# EAGLE design aa battery (EAGLE 6.4)
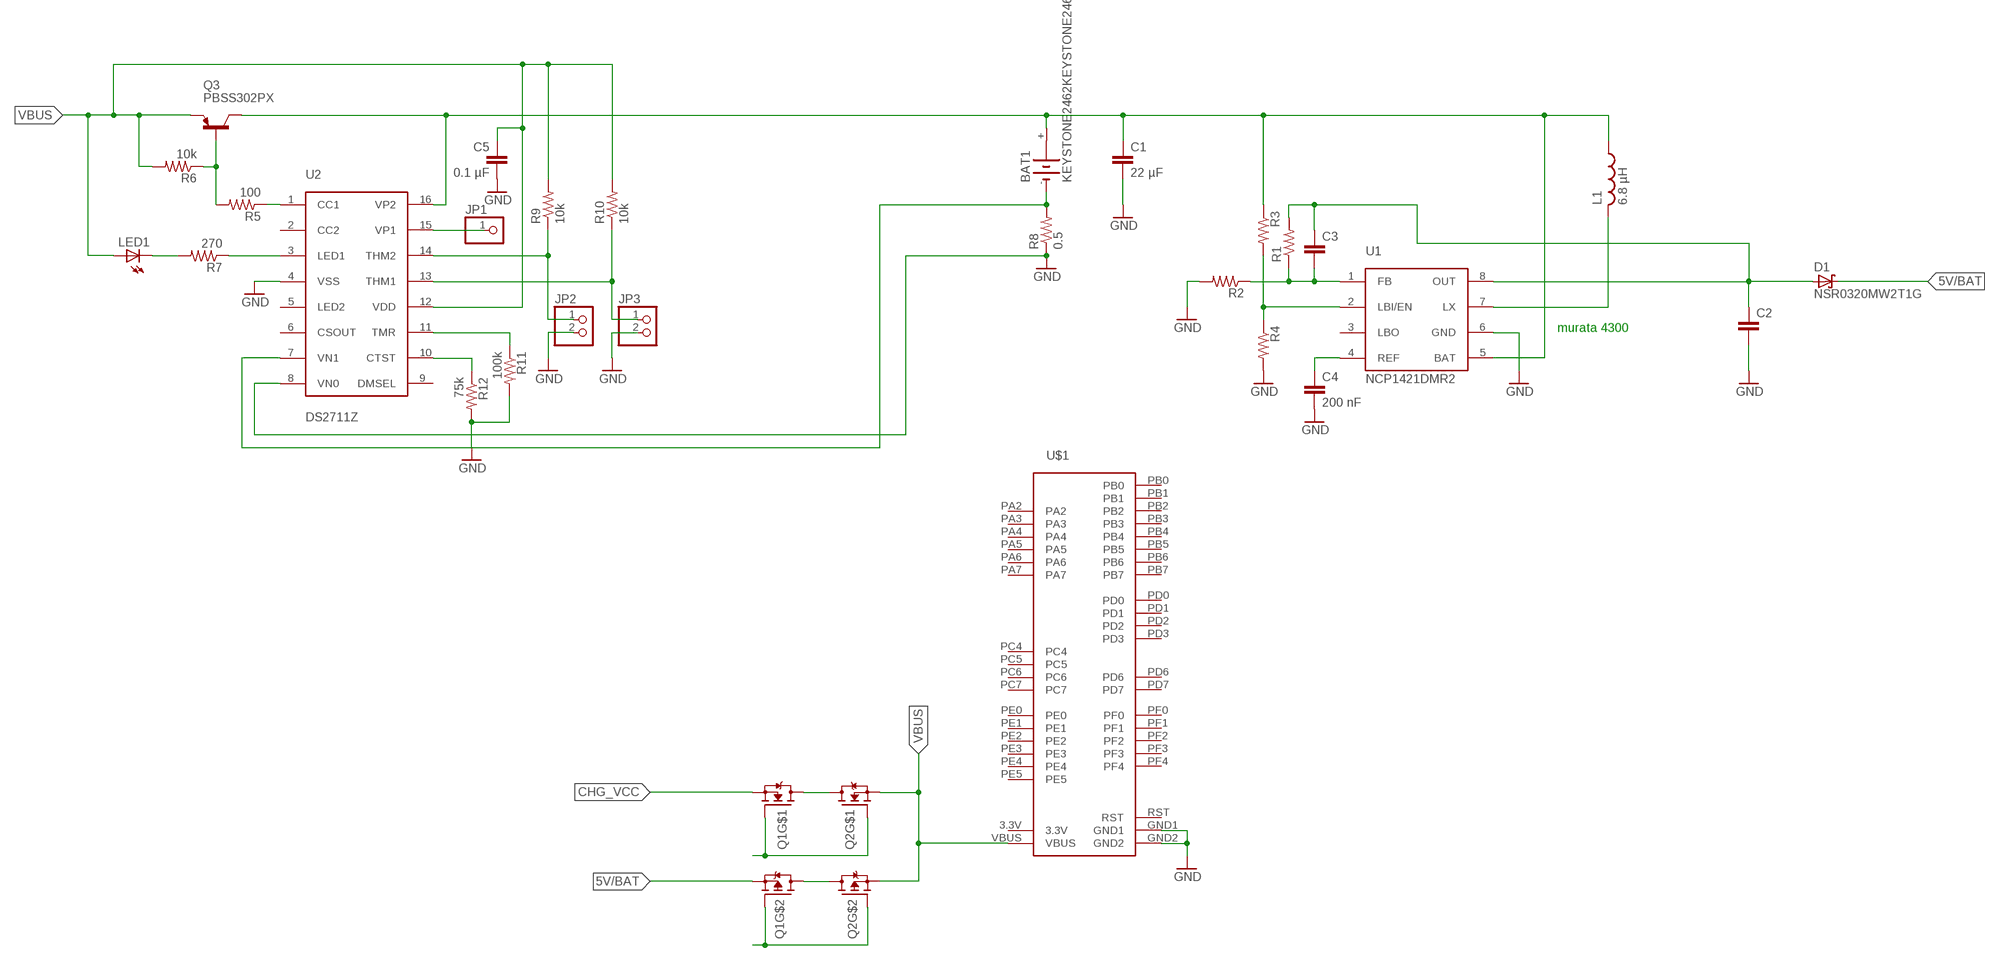
[diagram p0: schematic, sheet 1]

## Parts
BAT1  KEYSTONE2462KEYSTONE2462  [KEYSTONE2462]
C1  22 µF  C-EUC0805  [C0805]
C2  C-EUC1210  [C1210]
C3  C-EUC0805  [C0805]
C4  200 nF  C-EUC0805  [C0805]
C5  0.1 µF  C-EUC0805  [C0805]
D1  NSR0320MW2T1G  SCHOTTKY-DIODENSR0320MW2T1G  [SOD323]
JP1  PINHD-1X1  [1X01]
JP2  PINHD-1X2  [1X02]
JP3  PINHD-1X2  [1X02]
L1  6.8 µH  L-USMURATA4500  [MURATA4500]
LED1  LED5MM  [LED5MM]
Q1  DMC2038LVT-7  [TSOT26]
Q2  DMC2038LVT-7  [TSOT26]
Q3  PBSS302PX  BF621-PNP-SOT98-BCE  [SOT89-BCE]
R1  R-US_R0805  [R0805]
R2  R-US_R0805  [R0805]
R3  R-US_R0805  [R0805]
R4  R-US_R0805  [R0805]
R5  100  R-US_R0805  [R0805]
R6  10k  R-US_R0805  [R0805]
R7  270  R-US_R0805  [R0805]
R8  0.5  R-US_R0805  [R0805]
R9  10k  R-US_R0805  [R0805]
R10  10k  R-US_R0805  [R0805]
R11  100k  R-US_R0805  [R0805]
R12  75k  R-US_R0805  [R0805]
U1  NCP1421DMR2  [MICRO8]
U2  DS2711Z  [SO16]
U$1  STELLARIS-LAUNCHPADSTELLARIS-LAUNCHPAD-XL  [LAUNCHPAD-XL]

## Nets
5V/BAT: D1.C Q1.2(S1)
CHG_VCC: Q1.5(S)
GND: C1.2 C2.2 C4.2 C5.2 JP2.2 JP3.2 R2.2 R4.2 R8.1 R11.2 R12.2 U1.6(GND) U2.4(VSS) U2.8(VN0) U$1.GND1 U$1.GND2
N$1: C4.1 U1.4(REF)
N$2: L1.2 U1.7(LX)
N$3: C3.2 R1.1 R2.1 U1.1(FB)
N$4: Q1.4(D1) Q2.4(D1)
N$5: R3.2 R4.1 U1.2(LBI/EN)
N$6: BAT1.+ C1.1 L1.1 Q3.C Q3.C@1(C) R3.1 U1.5(BAT) U2.16(VP2)
N$7: Q3.B R5.2 R6.1
N$8: Q1.6(D) Q2.6(D)
N$9: Q1.1(G) Q2.1(G)
N$10: R5.1 U2.1(CC1)
N$11: C2.1 C3.1 D1.A R1.2 U1.8(OUT)
N$12: Q1.3(G1) Q2.3(G1)
N$13: JP1.1 U2.15(VP1)
N$14: BAT1.- R8.2 U2.7(VN1)
N$15: LED1.K(C) R7.2
N$16: R7.1 U2.3(LED1)
N$17: JP2.1 R9.1 U2.14(THM2)
N$18: JP3.1 R10.1 U2.13(THM1)
N$20: R12.1 U2.10(CTST)
N$21: R11.1 U2.11(TMR)
VBUS: C5.1 LED1.A Q2.2(S1) Q2.5(S) Q3.E R6.2 R9.2 R10.2 U2.12(VDD) U$1.VBUS
Unconnected: U1.3(LBO) U2.2(CC2) U2.5(LED2) U2.6(CSOUT) U2.9(DMSEL) U$1.PA2 U$1.PA3 U$1.PA4 U$1.PA5 U$1.PA6 U$1.PA7 U$1.PB0 U$1.PB1 U$1.PB2 U$1.PB3 U$1.PB4 U$1.PB5 U$1.PB6 U$1.PB7 U$1.PC4 U$1.PC5 U$1.PC6 U$1.PC7 U$1.PD0 U$1.PD1 U$1.PD2 U$1.PD3 U$1.PD6 U$1.PD7 U$1.PE0 U$1.PE1 U$1.PE2 U$1.PE3 U$1.PE4 U$1.PE5 U$1.PF0 U$1.PF1 U$1.PF2 U$1.PF3 U$1.PF4

## Notes on the sheet
- murata 4300

## Power pins joined to a net without a drawn wire
3.3V: U$1.3.3V
RST: U$1.RST

## Library data of the parts
BAT1 = battery holders:KEYSTONE2462
C1-C5 = rcl:C-EU: CAPACITOR, European symbol
D1 = sod323-diode:SCHOTTKY-DIODE
JP1 = pinhead:PINHD-1X1: PIN HEADER
JP2 JP3 = pinhead:PINHD-1X2: PIN HEADER
L1 = inductors:L-US: INDUCTOR, American symbol
LED1 = led:LED: LED OSRAM: - CHIPLED LG R971, LG N971, LY N971, LG Q971, LY Q971, LO R971, LY R971 LH N974, LH R974 LS Q976, LO Q976, LY Q976 LO Q996 - Hyper CHIPLED LW Q18S LB Q993, LB Q99A, LB R99A - SideLED LS A670, LO A670, LY A670, LG A670, LP A670 LB A673, LV A673, LT A673, LW A673 LH A674 LY A675 LS A676, LA A676, LO A676, LY A676, LW A676 LS A679, LY A679, LG A679 - Hyper Micro SIDELED® LS Y876, LA Y876, LO Y876, LY Y876 LT Y87S - SmartLED LW L88C, LW L88S LB L89C, LB L89S, LG L890 LS L89K, LO L89K, LY L89K LS L896, LA L896, LO L896, LY L896 - TOPLED LS T670, LO T670, LY T670, LG T670, LP T670 LSG T670, LSP T670, LSY T670, LOP T670, LYG T670 LG T671, LOG T671, LSG T671 LB T673, LV T673, LT T673, LW T673 LH T674 LS T676, LA T676, LO T676, LY T676, LB T676, LH T676, LSB T676, LW T676 LB T67C, LV T67C, LT T67C, LS T67K, LO T67K, LY T67K, LW E67C LS E67B, LA E67B, LO E67B, LY E67B, LB E67C, LV E67C, LT E67C LW T67C LS T679, LY T679, LG T679 LS T770, LO T770, LY T770, LG T770, LP T770 LB T773, LV T773, LT T773, LW T773 LH T774 LS E675, LA E675, LY E675, LS T675 LS T776, LA T776, LO T776, LY T776, LB T776 LHGB T686 LT T68C, LB T68C - Hyper Mini TOPLED® LB M676 - Mini TOPLED Santana® LG M470 LS M47K, LO M47K, LY M47K Source: http://www.osram.convergy.de LUXEON: - LUMILED® LXK2-PW12-R00, LXK2-PW12-S00, LXK2-PW14-U00, LXK2-PW14-V00 LXK2-PM12-R00, LXK2-PM12-S00, LXK2-PM14-U00 LXK2-PE12-Q00, LXK2-PE12-R00, LXK2-PE12-S00, LXK2-PE14-T00, LXK2-PE14-U00 LXK2-PB12-K00, LXK2-PB12-L00, LXK2-PB12-M00, LXK2-PB14-N00, LXK2-PB14-P00, LXK2-PB14-Q00 LXK2-PR12-L00, LXK2-PR12-M00, LXK2-PR14-Q00, LXK2-PR14-R00 LXK2-PD12-Q00, LXK2-PD12-R00, LXK2-PD12-S00 LXK2-PH12-R00, LXK2-PH12-S00 LXK2-PL12-P00, LXK2-PL12-Q00, LXK2-PL12-R00 Source: www.luxeon.com KINGBRIGHT: KA-3528ASYC Source: www.kingbright.com
Q1 Q2 = mosfets:DMC2038LVT
Q3 = transistor-neu-to92:*-PNP-: PNP Transistror
R1-R12 = rcl:R-US_: RESISTOR, American symbol
U1 = NCP1421:NCP1421
U2 = DS2711:DS2711
U$1 = StellarisLaunchPad_Fred:STELLARIS-LAUNCHPAD

## Board
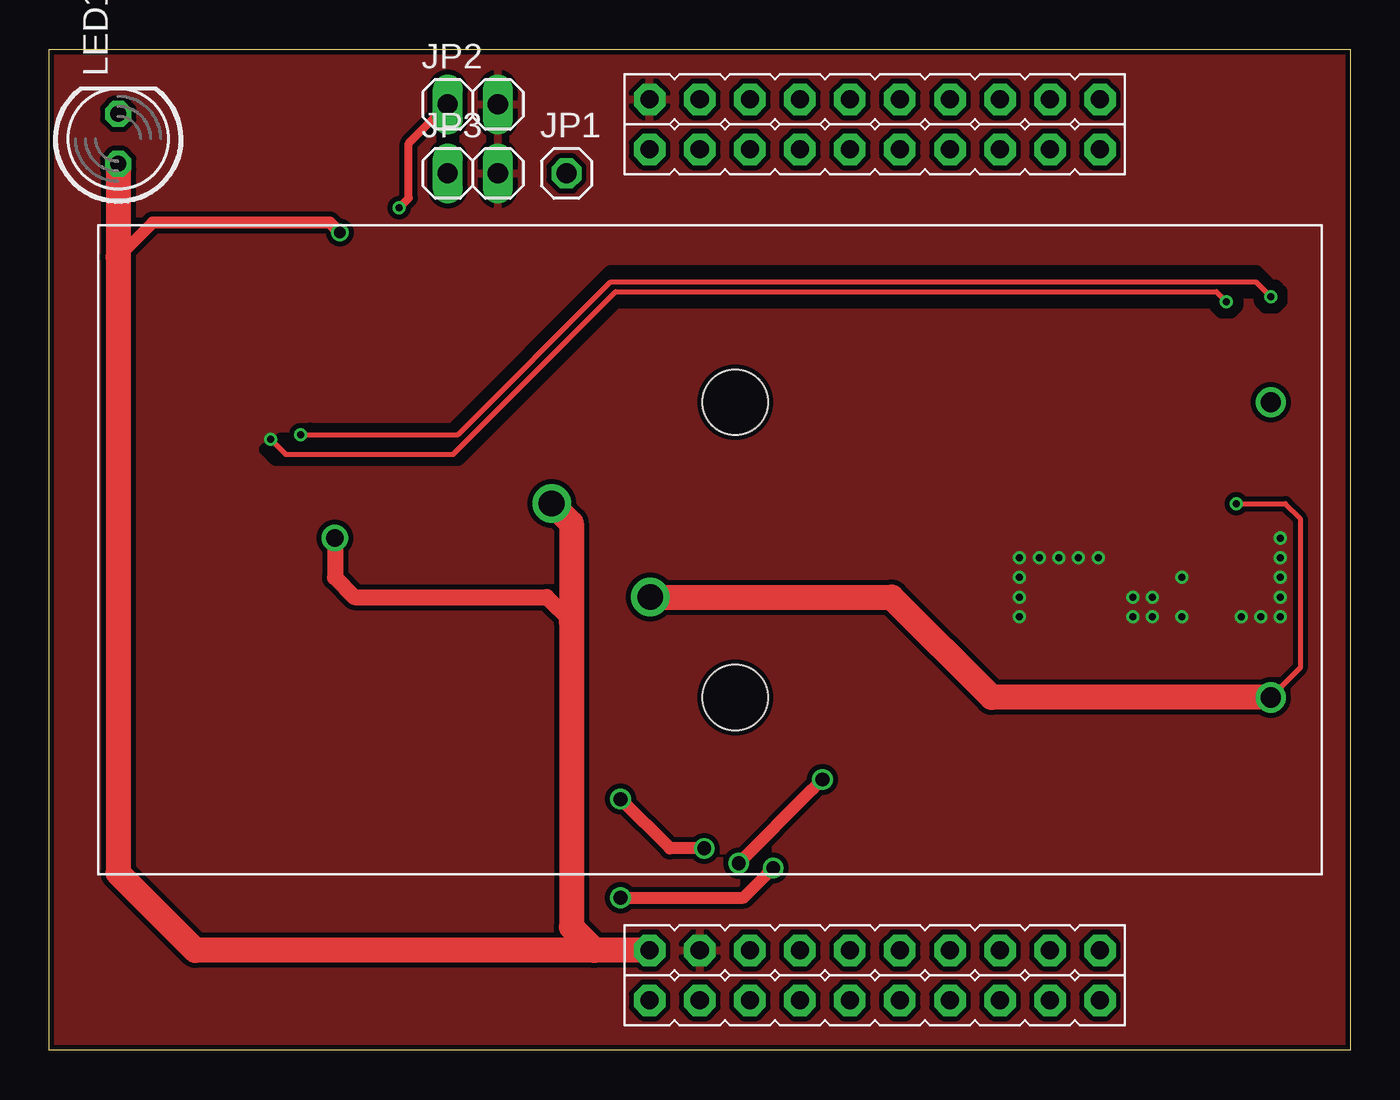
[diagram p1: board, top side]
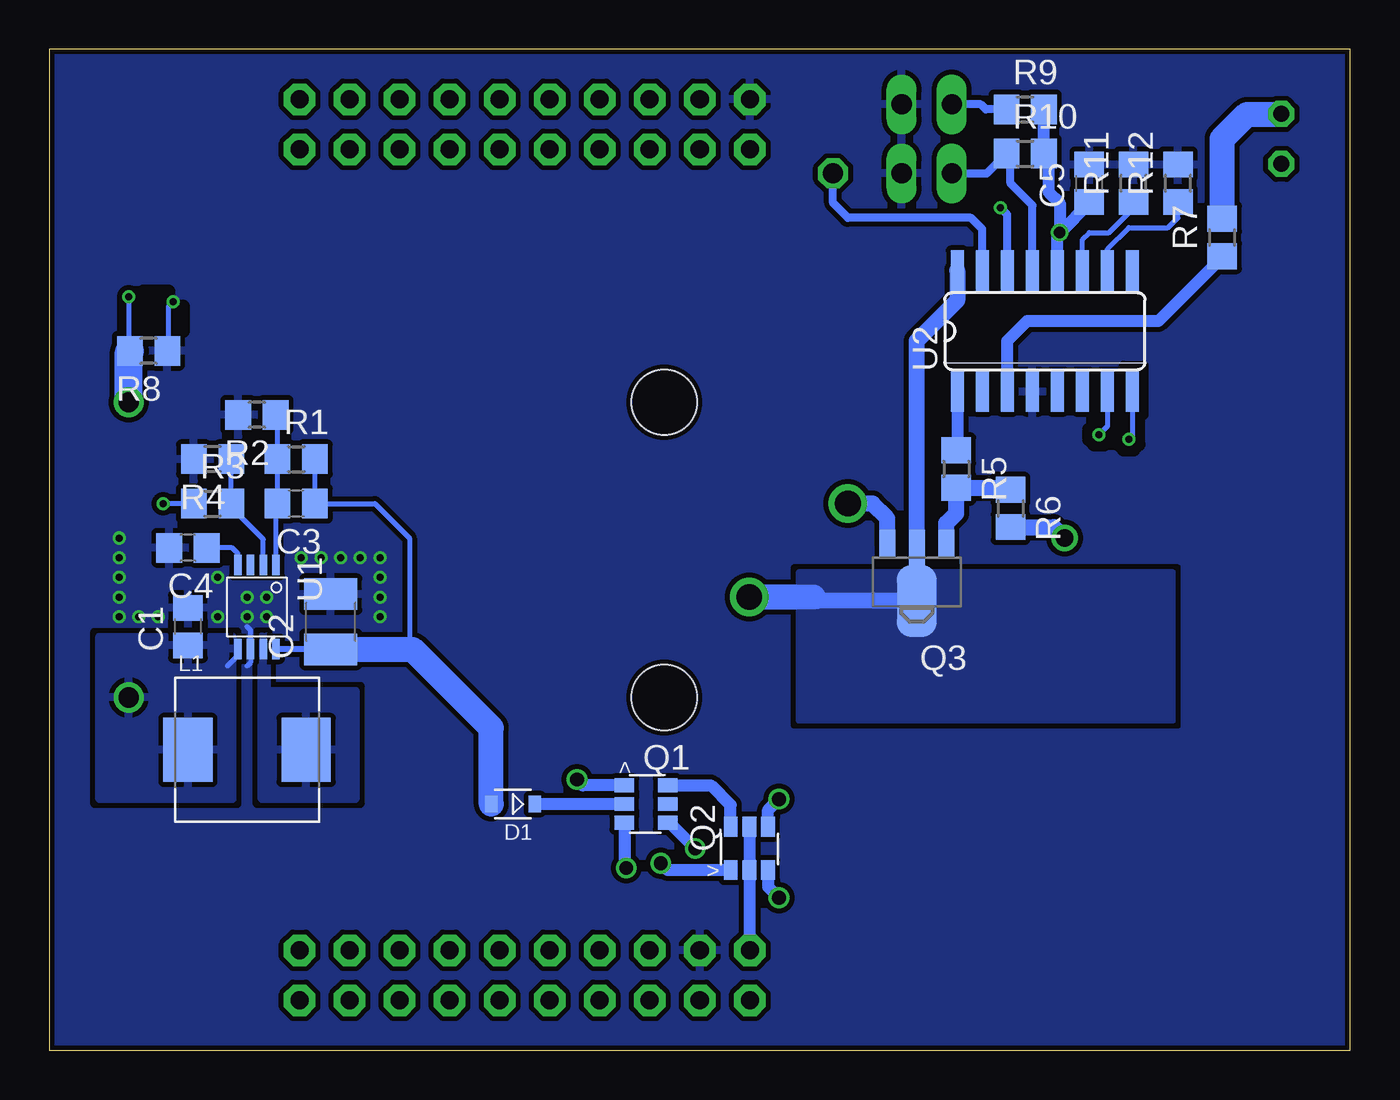
[diagram p2: board, bottom side, seen from below]

Size 66.04 x 50.8 mm. Coordinates in mm from the lower left corner, seen from the top.
Copper layers (1*16): Top 0.035mm / dielectric 1.5mm / Bottom 0.035mm
Design rules "ITEADstudio_DRC": minimum track width 6mil, minimum drill 12mil, track to track 6mil, track to pad 6mil, pad to pad 6mil, via to via 6mil, smd to smd 0mil, copper to edge 10mil, drill to drill 10mil, minimum pad ring 10mil, minimum via ring 6mil, stop-mask expansion 2mil, vias tented up to drill 100mil, thermal gap 10mil
tRestrict: area 11,30 to 62.5,39.5
bRestrict: area 10.5,32.2 to 11.5,34.8; area 10.8,30.5 to 13.2,32.2; area 59.2,36.5 to 62.2,38.5

### Footprints (pad centres in the part's own frame; a part is rotated, then mirrored left to right if it is on the bottom)
KEYSTONE2462 = drill 1.016: + 0,-7.493; - 0,7.493 | hole 3.302: -27.178,7.493; -27.178,-7.493
C0805 = smd 1.3 x 1.5: 1 -0.95,0; 2 0.95,0
C1210 = smd 1.6 x 2.7: 1 -1.4,0; 2 1.4,0
SOD323 = smd 0.63 x 0.83: A 1.11,0; C -1.11,0
1X01 = drill 1.016 octagon: 1 0,0
1X02 = drill 1.016 long: 1 -1.27,0; 2 1.27,0
MURATA4500 = smd 2.5 x 3.25: 1 -3,0; 2 3,0
LED5MM = drill 0.813 octagon: A -1.27,0; K 1.27,0
TSOT26 = smd 0.7 x 1: 1 -0.95,-1.099; 2 0,-1.099; 3 0.95,-1.099; 4 0.95,1.099; 5 0,1.099; 6 -0.95,1.099
SOT89-BCE = smd 0.8 x 1.4: B -1.499,-1.981; E 1.499,-1.981 | smd 0.8 x 1.9: C 0,-1.727 | smd 2.032 x 3.65: C@1 0,0.94
R0805 = smd 1.3 x 1.5: 1 -0.95,0; 2 0.95,0
MICRO8 = smd 0.38 x 1.05: 1 -0.975,-2.125; 2 -0.325,-2.125; 3 0.325,-2.125; 4 0.975,-2.125; 5 0.975,2.125; 6 0.325,2.125; 7 -0.325,2.125; 8 -0.975,2.125
SO16 = smd 0.66 x 2.032: 1 -4.445,-3.073; 2 -3.175,-3.073; 3 -1.905,-3.073; 4 -0.635,-3.073; 5 0.635,-3.073; 6 1.905,-3.073; 7 3.175,-3.073; 8 4.445,-3.073; 9 4.445,3.073; 10 3.175,3.073; 11 1.905,3.073; 12 0.635,3.073; 13 -0.635,3.073; 14 -1.905,3.073; 15 -3.175,3.073; 16 -4.445,3.073
LAUNCHPAD-XL = drill 0.914 pad 1.6 octagon: 3.3V 30.48,2.54; GND1 33.02,5.08; GND2 30.48,48.26; PA2 53.34,48.26; PA3 50.8,48.26; PA4 48.26,48.26; PA5 48.26,2.54; PA6 50.8,2.54; PA7 53.34,2.54; PB0 35.56,2.54; PB1 38.1,2.54; PB2 33.02,48.26; PB3 35.56,45.72; PB4 45.72,2.54; PB5 33.02,2.54; PB6 45.72,48.26; PB7 43.18,48.26; PC4 38.1,45.72; PC5 40.64,45.72; PC6 43.18,45.72; PC7 45.72,45.72; PD0 35.56,5.08; PD1 38.1,5.08; PD2 40.64,5.08; PD3 43.18,5.08; PD6 48.26,45.72; PD7 50.8,45.72; PE0 35.56,48.26; PE1 45.72,5.08; PE2 48.26,5.08; PE3 50.8,5.08; PE4 40.64,2.54; PE5 43.18,2.54; PF0 38.1,48.26; PF1 53.34,5.08; PF2 30.48,45.72; PF3 33.02,45.72; PF4 53.34,45.72; RST 40.64,48.26; VBUS 30.48,5.08

### Placement (x,y rotation side)
BAT1  62,25.4 0 top
C1  59,21.5 90 bottom
C2  51.75,21.75 90 bottom
C3  53.5,27.75 180 bottom
C4  59,25.5 180 bottom
C5  13.25,44 90 bottom
D1  42.5,12.5 180 bottom
JP1  26.25,44.5 0 top
JP2  21.5,48 0 top
JP3  21.5,44.5 0 top
L1  56,15.25 0 bottom
LED1  3.5,46.25 90 top
Q1  35.75,12.5 270 bottom
Q2  30.5,10.25 0 bottom
Q3  22,23.75 180 bottom
R1  53.5,30 0 bottom
R2  55.5,32.25 180 bottom
R3  57.75,27.75 0 bottom
R4  57.75,30 180 bottom
R5  20,29.5 270 bottom
R6  17.25,27.5 270 bottom
R7  6.5,41.25 90 bottom
R8  61,35.5 180 bottom
R9  16.5,47.75 0 bottom
R10  16.5,45.5 0 bottom
R11  11,44 90 bottom
R12  8.75,44 90 bottom
U1  55.5,22.5 180 bottom
U2  15.5,36.5 0 bottom
U$1  0,0 0 top

### Tracks (layer width: path | path; a pad name or v marks a point on that pad's centre or on a via)
5V/BAT
  Bottom 0.61: Q1.2 D1.C
GND  (via drill 0.36)
  Top 0.254: v11.25,31 12,30.25 20.5,30.25 28.75,38.5 59.25,38.5 v59.75,38
  Bottom 0.254: 56,19.5 55.83,19.68 U1.6 55.83,21.32 56,21.5 | U2.8 11.05,31.2 v11.25,31 | v59.75,38 60,37.75 60,35.55 R8.1
  other vias: 49.25,22 49.25,23 49.25,24 49.25,25 50.25,25 51.25,25 52.25,25 53.25,25 57.5,22 57.5,24 60.5,22 55,23 55,22 56,23 56,22 61.5,22 62.5,22 62.5,23 62.5,24 62.5,25 62.5,26
  pour Bottom (isolate 0.254, rank 6): 0,0 66,0 66,51 0,51
  pour Top (isolate 0.254, rank 6): 0,0 66,0 66,51 0,51
N$1
  Bottom 0.254: U1.4 56.48,25.23 56.75,25.5 C4.1
N$2
  pour Bottom (isolate 0.254): 50.5,12.75 55.25,12.75 55.25,21 55,21 55,18.25 50.5,18.25
N$3
  Bottom 0.254: U1.1 54.52,27.68 C3.2 R1.1 54.45,32.15 R2.1
N$4  (via drill 0.7)
  Top 0.61: v29,12.75 31.5,10.25 v33.25,10.25
  Bottom 0.61: 33.4,10.4 v33.25,10.25 34.55,11.55 Q1.4 | Q2.4 29.55,12.2 v29,12.75
N$5
  Bottom 0.254: U1.2 55.17,25.93 56.8,27.55 R3.2 R4.1
N$6  (via drill 0.36, 1.3)
  Top 0.254: v60.25,27.75 62.75,27.75 63.5,27 63.5,19.41 BAT1.+
  Top 1.27: v30.5,23 42.75,23 47.84,17.91 BAT1.+
  Bottom 0.254: U1.5 56.48,20.02 57,19.5 | R3.1 v60.25,27.75
  Bottom 0.813: U2.16 19.95,38.05 22,36 Q3.C Q3.C@1 27.06,22.81 27.25,23
  Bottom 1.27: 27.25,23 v30.5,23
  pour Bottom (isolate 0.254): 56.75,21 56.75,12.75 63.5,12.75 63.5,21
  pour Bottom (isolate 0.254, no thermals): 9,24.25 28,24.25 28,16.75 9,16.75
N$7
  Bottom 0.813: Q3.B 20.5,26.75 20,27.25 R5.2 17.35,28.55 R6.1
N$8
  Bottom 0.61: Q1.6 32.45,13.45 31.45,12.45 Q2.6
N$9  (via drill 0.7)
  Top 0.61: v35,9.5 38.75,13.25 v39.25,13.75
  Bottom 0.61: Q2.1 34.65,9.15 v35,9.5 | Q1.1 38.95,13.45 v39.25,13.75
N$10
  Bottom 0.61: U2.1 19.95,30.5 R5.1
N$11
  Bottom 0.254: R1.2 C3.1 49.5,27.75 47.75,26 47.75,20.35
  Bottom 0.305: U1.8 52.52,20.38 C2.1
  Bottom 1.27: D1.A 43.61,16.36 47.6,20.35 47.75,20.35 C2.1
N$12  (via drill 0.7)
  Top 0.61: v29,7.75 35.25,7.75 36.38,8.88 v36.75,9.25
  Bottom 0.61: Q2.3 29.55,8.3 v29,7.75 | Q1.3 36.85,9.35 v36.75,9.25
N$13
  Bottom 0.406: U2.15 18.68,41.67 19.25,42.25 25.5,42.25 26.25,43 JP1.1
N$14  (via drill 0.36)
  Top 0.254: v12.75,31.25 20.75,31.25 28.5,39 61.25,39 v62,38.25
  Bottom 0.254: U2.7 12.32,31.68 v12.75,31.25 | v62,38.25 62,35.55 R8.2
  Bottom 1.422: BAT1.- 62,35.45 R8.2
N$15
  Bottom 1.27: R7.2 6.5,46.25 5.25,47.5 3.52,47.5 LED1.K
N$16
  Bottom 0.61: U2.3 17.41,36 16.41,37 9.75,37 6.5,40.25 R7.1
N$17  (via drill 0.36)
  Top 0.406: v17.75,42.75 18.25,43.25 18.25,46.02 JP2.1
  Bottom 0.406: 17.45,48 R9.1 18.5,47.75 18.75,48 JP2.1 | U2.14 17.41,42.41 v17.75,42.75
N$18
  Bottom 0.406: U2.13 16.14,42.88 17.25,44 17.25,45.3 R10.1 18.45,44.5 JP3.1
N$20
  Bottom 0.254: U2.10 12.32,40.67 11.25,41.75 9.25,41.75 8.75,42.25 R12.1
N$21
  Bottom 0.254: U2.11 13.6,41.16 13.25,41.5 12.25,41.5 11.25,42.5 11.25,42.8 R11.1
VBUS  (via drill 0.6, 0.9, 1.3)
  Top 0.61: v14.75,41.5 14.25,42 5.25,42 3.5,40.25
  Top 0.813: v14.5,26 14.5,24 15.5,23 25.25,23 26.5,21.75
  Top 1.27: v25.5,27.75 26.5,26.75 26.5,21.75 26.5,6.25 27.67,5.08 | LED1.A 3.5,40.25 3.5,9 7.42,5.08 27.67,5.08 | U$1.VBUS 27.67,5.08
  Bottom 0.61: U$1.VBUS 30.5,5.1 Q2.2 Q2.5 | U2.12 14.87,41.38 v14.75,41.5 | C5.1 13.25,43 v14.75,41.5 | v14.75,41.5 14.75,43 15.3,43.55 15.3,45.25 R10.2 R9.2
  Bottom 0.813: Q3.E 23.5,27 24.25,27.75 v25.5,27.75 | R6.2 15.05,26.55 v14.5,26